# Altium schematic sheet SensorPlatformV3.SchDoc
size A4; DrawnBy: William Rigby; Engineer: William Rigby; Organization: University of Queensland; DocumentNumber: 1; Revision: C; SheetNumber: 1; SheetTotal: 1; ProjectName: Water Quality Monitor
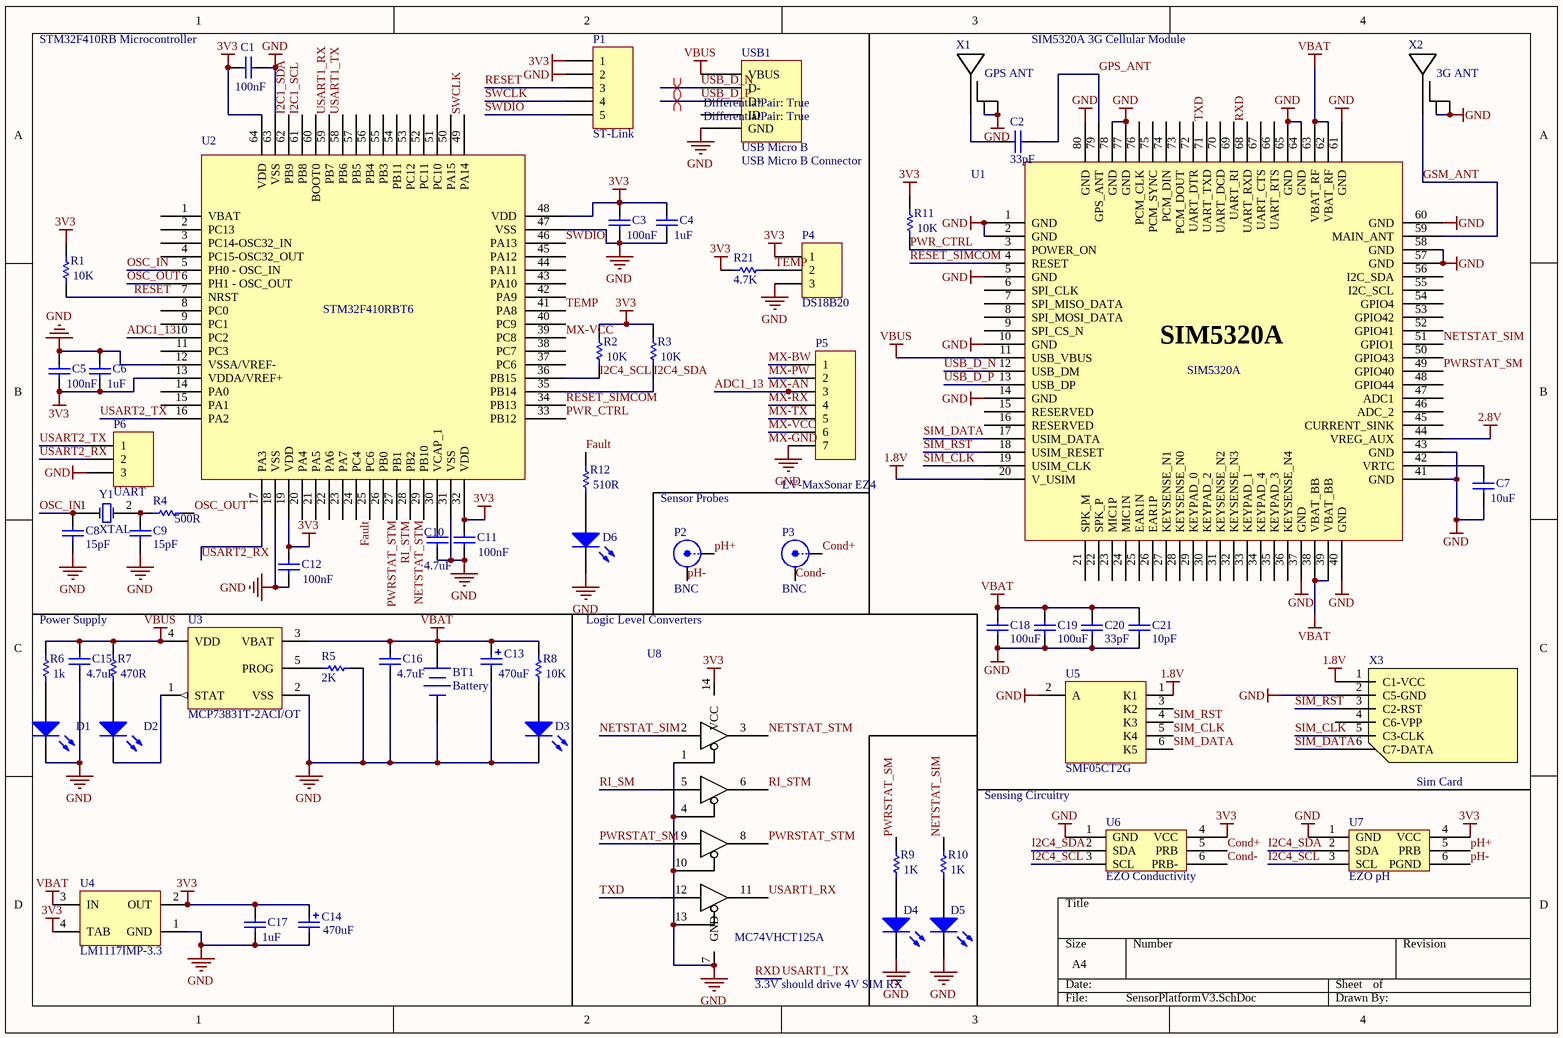
[diagram p0: SensorPlatformV3.SchDoc]

## Parts
BT1  Battery  [BAT-2]
C1  value 100nF  [1608[0603]]  (hidden comment: Cap)
C2  value 33pF  [1608[0603]]  (hidden comment: Cap)
C3  value 100nF  [1608[0603]]  (hidden comment: Cap)
C4  value 1uF  [1608[0603]]  (hidden comment: Cap)
C5  value 100nF  [1608[0603]]  (hidden comment: Cap)
C6  value 1uF  [1608[0603]]  (hidden comment: Cap)
C7  value 10uF  [1608[0603]]  (hidden comment: Cap)
C8  value 15pF  [1608[0603]]  (hidden comment: Cap)
C9  value 15pF  [1608[0603]]  (hidden comment: Cap)
C10  value 4.7uF  [1608[0603]]  (hidden comment: Cap)
C11  value 100nF  [1608[0603]]  (hidden comment: Cap)
C12  value 100nF  [1608[0603]]  (hidden comment: Cap)
C13  value 470uF  [CAPAE9983X105M]  (hidden comment: Cap Pol2)
C14  value 470uF  [CAPAE9983X105M]  (hidden comment: Cap Pol2)
C15  value 4.7uF  [1608[0603]]  (hidden comment: Cap)
C16  value 4.7uF  [1608[0603]]  (hidden comment: Cap)
C17  value 1uF  [1608[0603]]  (hidden comment: Cap)
C18  value 100uF  [1608[0603]]  (hidden comment: Cap)
C19  value 100uF  [1608[0603]]  (hidden comment: Cap)
C20  value 33pF  [1608[0603]]  (hidden comment: Cap)
C21  value 10pF  [1608[0603]]  (hidden comment: Cap)
D1  USB  [1608[0603]]  (value not drawn)
D2  Ch  [1608[0603]]  (value not drawn)
D3  Bt  [1608[0603]]  (value not drawn)
D4  PWRSTAT  [1608[0603]]  (value not drawn)
D5  NETSTAT  [1608[0603]]  (value not drawn)
D6  Fault  [1608[0603]]  (value not drawn)
P1  ST-Link  [HDR1X5]
P2  BNC  [BNC Connector]
P3  BNC  [BNC Connector]
P4  DS18B20  [HDR1X3]
P5  LV-MaxSonar EZ4  [HDR1X7]
P6  UART  [HDR1X3]
R1  value 10K  [1608[0603]]  (hidden comment: Res1)
R2  value 10K  [1608[0603]]  (hidden comment: Res1)
R3  value 10K  [1608[0603]]  (hidden comment: Res1)
R4  value 500R  [1608[0603]]  (hidden comment: Res1)
R5  value 2K  [1608[0603]]  (hidden comment: Res1)
R6  value 1k  [1608[0603]]  (hidden comment: Res1)
R7  value 470R  [1608[0603]]  (hidden comment: Res1)
R8  value 10K  [1608[0603]]  (hidden comment: Res1)
R9  value 1K  [1608[0603]]  (hidden comment: Res1)
R10  value 1K  [1608[0603]]  (hidden comment: Res1)
R11  value 10K  [1608[0603]]  (hidden comment: Res1)
R12  value 510R  [1608[0603]]  (hidden comment: Res1)
R21  value 4.7K  [1608[0603]]  (hidden comment: Res1)
U1  SIM5320A  [SIM5320A]
U2  STM32F410RBT6  [STM32F410RBT6]
U3  MCP73831T-2ACI/OT  [SOT-23-OT5_N]
U4  LM1117IMP-3.3  [MP04A_N]
U5  SMF05CT2G  [ONSC-SC70-6-419B-02_W_V]
U6  EZO Conductivity  [EZO Conductivity (No Writing)]
U7  EZO pH  [EZO pH Duplicate]
U8  MC74VHCT125A  [TSSOP-14]
USB1  USB Micro B Connector  [USB Micro B Connector]
X1  GPS ANT  [UFL Connector]
X2  3G ANT  [UFL Connector]
X3  Sim Card  [Sim Card]
Y1  XTAL  [16MHz Clock]

## Nets
1.8V: U1.20(V_USIM) U5.1(K1) X3.1(C1-VCC)
2.8V: U1.44(VREG_AUX)
3V3: C1.2 C3.2 C4.2 C5.1 C6.1 C11.2 C12.2 C14.1 C17.2 P1.1 P4.1 R1.2 R2.2 R3.2 R11.2 R21.2 U2.13(VDDA/VREF+) U2.19(VDD) U2.32(VDD) U2.48(VDD) U2.64(VDD) U4.2(OUT) U4.4(TAB) U6.4(VCC) U7.4(VCC) U8.14(VCC)
GND: BT1.2(-) C1.1 C3.1 C4.1 C5.2 C6.2 C7.1 C8.2 C9.2 C10.1 C11.1 C12.1 C13.2 C14.2 C15.1 C16.1 C17.1 C18.2 C19.2 C20.2 C21.2 D1.2(K) D3.2(K) D4.2(K) D5.2(K) D6.2(K) P1.2 P4.3 P5.7 P6.3 R5.1 U1.1(GND) U1.2(GND) U1.5(GND) U1.10(GND) U1.14(GND) U1.37(GND) U1.40(GND) U1.41(GND) U1.43(GND) U1.57(GND) U1.58(GND) U1.60(GND) U1.61(GND) U1.64(GND) U1.65(GND) U1.77(GND) U1.78(GND) U1.80(GND) U2.12(VSSA/VREF-) U2.18(VSS) U2.31(VSS) U2.47(VSS) U2.63(VSS) U3.2(VSS) U4.1(GND) U5.2(A) U6.1(GND) U7.1(GND) U8.1(OE1) U8.4(OE2) U8.7(GND) U8.10(OE3) U8.13(OE4) USB1.GND X1.2(GND) X1.3(GND) X2.2(GND) X2.3(GND) X3.2(C5-GND)
VBAT: BT1.1(+) C13.1 C16.2 C18.1 C19.1 C20.1 C21.1 R8.2 U1.38(VBAT_BB) U1.39(VBAT_BB) U1.62(VBAT_RF) U1.63(VBAT_RF) U3.3(VBAT) U4.3(IN)
VBUS: C15.2 R6.2 R7.2 U1.11(USB_VBUS) U3.4(VDD) USB1.VBUS
ADC1_13: P5.3 U2.10(PC2)  [also labelled MX-AN]
Cond+: P3.1(X) U6.5(PRB)
Cond-: P3.2(Y) U6.6(PRB-)
Fault: R12.2 U2.24(PC4)
GPS_ANT: C2.1 U1.79(GPS_ANT)
GSM_ANT: U1.59(MAIN_ANT) X2.1(SIG)
I2C1_SCL: U2.61(PB8)
I2C1_SDA: U2.62(PB9)
I2C4_SCL: R2.1 U2.36(PB15) U6.3(SCL) U7.3(SCL)
I2C4_SDA: R3.1 U2.35(PB14) U6.2(SDA) U7.2(SDA)
MX-BW: P5.1
MX-PW: P5.2
MX-RX: P5.4
MX-TX: P5.5
MX-VCC: P5.6 U2.39(PC8)
NETSTAT_SIM: R10.2 U1.51(GPIO1) U8.2(A1)
NETSTAT_STM: U2.28(PB2) U8.3(Y1)
OSC_IN: C8.1 U2.5(PH0_-_OSC_IN) Y1.1(OSC1)
OSC_OUT: R4.1 U2.6(PH1_-_OSC_OUT)
pH+: P2.1(X) U7.5(PRB)
pH-: P2.2(Y) U7.6(PGND)
PWR_CTRL: R11.1 U1.3(POWER_ON) U2.33(PB12)
PWRSTAT_SM: R9.2 U1.49(GPIO40) U8.9(A3)
PWRSTAT_STM: U2.26(PB0) U8.8(U4)
RESET: P1.3 R1.1 U2.7(NRST)
RESET_SIMCOM: U1.4(RESET) U2.34(PB13)
RI_SM: U8.5(A2)
RI_STM: U2.27(PB1) U8.6(Y2)
RXD: U1.68(UART_RXD) U2.58(PB6)  [also labelled USART1_TX]
SIM_CLK: U1.19(USIM_CLK) U5.5(K4) X3.5(C3-CLK)
SIM_DATA: U1.17(USIM_DATA) U5.6(K5) X3.6(C7-DATA)
SIM_RST: U1.18(USIM_RESET) U5.4(K3) X3.3(C2-RST)
SWCLK: P1.4 U2.49(PA14)
SWDIO: P1.5 U2.46(PA13)
TEMP: P4.2 R21.1 U2.41(PA8)
TXD: U1.71(UART_TXD) U8.12(A4)
USART1_RX: U2.59(PB7) U8.11(Y4)
USART2_RX: P6.2 U2.17(PA3)
USART2_TX: P6.1 U2.16(PA2)
USB_D_N: U1.12(USB_DM) USB1.D-
USB_D_P: U1.13(USB_DP) USB1.D+
NetC2_2: C2.2 X1.1(SIG)
NetC7_2: C7.2 U1.42(VRTC)
NetC9_1: C9.1 R4.2 Y1.2(OSC2)
NetC10_2: C10.2 U2.30(VCAP_1)
NetD1_1: D1.1(A) R6.1
NetD2_1: D2.1(A) R7.1
NetD2_2: D2.2(K) U3.1(STAT)
NetD3_1: D3.1(A) R8.1
NetD4_1: D4.1(A) R9.1
NetD5_1: D5.1(A) R10.1
NetD6_1: D6.1(A) R12.1
NetR5_2: R5.2 U3.5(PROG)

Not connected (* = marked no-connect by the designer): U1 6(SPI_CLK) 7(SPI_MISO_DATA) 8(SPI_MOSI_DATA) 9(SPI_CS_N) 15(RESERVED) 16(RESERVED) 21(SPK_M) 22(SPK_P) 23(MIC1P) 24(MIC1N) 25(EAR1N) 26(EAR1P) 27(KEYSENSE_N1) 28(KEYSENSE_N0) 29(KEYPAD_0) 30(KEYPAD_2) 31(KEYSENSE_N2) 32(KEYSENSE_N3) 33(KEYPAD_1) 34(KEYPAD_4) 35(KEYPAD_3) 36(KEYSENSE_N4) 45(CURRENT_SINK) 46(ADC_2) 47(ADC1) 48(GPIO44) 50(GPIO43) 52(GPIO41) 53(GPIO42) 54(GPIO4) 55(I2C_SCL) 56(I2C_SDA) 66(UART_RTS) 67(UART_CTS) 69(UART_RI) 70(UART_DCD) 72(UART_DTR) 73(PCM_DOUT) 74(PCM_DIN) 75(PCM_SYNC) 76(PCM_CLK); U2 1(VBAT) 2(PC13) 3(PC14-OSC32_IN) 4(PC15-OSC32_OUT) 8(PC0) 9(PC1) 11(PC3) 14(PA0) 15(PA1) 20(PA4) 21(PA5) 22(PA6) 23(PA7) 25(PC6) 29(PB10) 37(PC6) 38(PC7) 40(PC9) 42(PA9) 43(PA10) 44(PA11) 45(PA12) 50(PA15) 51(PC10) 52(PC11) 53(PC12) 54(PB11) 55(PB3) 56(PB4) 57(PB5) 60(BOOT0); U5 3(K2); USB1 ID; X3 4(C6-VPP)

## Layout directives
differential pair: USB_D_N, USB_D_P

## Notes on the sheet
- (near C1) STM32F410RB Microcontroller
- SIM5320A 3G Cellular Module
- Sensor Probes
- Power Supply
- Logic Level Converters
- Sensing Circuitry
- 3.3V should drive 4V SIM RX
- Labels drawn without touching a wire or pin: MX-GND
- (in symbol USB Micro B Connector) USB Micro B

## Library data of the parts
BT1 = Battery: Multicell Battery; Published: 24-Mar-1999; LatestRevisionDate: 17-Jul-2002; LatestRevisionNote: Re-released for DXP Platform.; PackageReference: BAT-2; Publisher: Altium Limited; PackageDescription: Battery; 2 Leads
C1-C12 C15-C21 = Cap: Capacitor; Published: 8-Jun-2000; LatestRevisionDate: 17-Jul-2002; LatestRevisionNote: Re-released for DXP Platform.; PackageReference: RAD-0.3; Publisher: Altium Limited; PackageDescription: Radial Cap, Thru-Hole; 2 Leads; 0.3 in Pin Spacing
C13 C14 = Cap Pol2: Polarized Capacitor (Axial); Published: 8-Jun-2000; LatestRevisionDate: 17-Jul-2002; LatestRevisionNote: Re-released for DXP Platform.; PackageReference: POLAR0.8; Publisher: Altium Limited; PackageDescription: Polarized Capacitor; 2 Leads
D1-D6 = LED0: Typical INFRARED GaAs LED; Published: 8-Jun-2000; LatestRevisionDate: 08-Jul-2005; LatestRevisionNote: Mech Layer 1 removed.; PackageReference: LED-0; Publisher: Altium Limited; PackageDescription: LED; 2 Leads
P1 = Header 5: Header, 5-Pin; LatestRevisionDate: 17-Jul-2002; LatestRevisionNote: Re-released for DXP Platform.; Publisher: Altium Limited
P2 P3 = BNC: BNC Elbow Connector; LatestRevisionDate: 17-Jul-2002; LatestRevisionNote: Re-released for DXP Platform.; Publisher: Altium Limited
P4 P6 = Header 3: Header, 3-Pin; LatestRevisionDate: 17-Jul-2002; LatestRevisionNote: Re-released for DXP Platform.; Publisher: Altium Limited
P5 = Header 7: Header, 7-Pin; LatestRevisionDate: 17-Jul-2002; LatestRevisionNote: Re-released for DXP Platform.; Publisher: Altium Limited
R1-R12 R21 = Res1: Resistor; Published: 8-Jun-2000; LatestRevisionDate: 17-Jul-2002; LatestRevisionNote: Re-released for DXP Platform.; PackageReference: AXIAL-0.3; Publisher: Altium Limited; PackageDescription: Axial Device, Thru-Hole; 2 Leads; 0.3 in Pin Spacing
U3 = MCP73831T-2ACI/OT: Miniature Single-Cell, Fully Integrated Li-Ion, Li-Polymer Charge Management Controller, 4.2V, 5-Pin SOT-23, Industrial Temperature, Tape and Reel; Manufacturer: Microchip; DatasheetVersion: revE, Sep-2008; PackageVersion: revBB, Aug-2009; PackageReference: SOT-23-OT5; PackageDescription: 5-Lead Plastic Small Outline Transistor (OT) [SOT-23]; Supplier 1: Digi-Key; Supplier Part Number 1: MCP73831T-2ACI/OTTR-ND; Supplier 2: Digi-Key; Supplier Part Number 2: MCP73831T-2ACI/OTCT-ND; Supplier 3: Digi-Key; Supplier Part Number 3: MCP73831T-2ACI/OTDKR-ND; Supplier 4: Farnell; Supplier Part Number 4: 1332158; Supplier 5: Farnell; Supplier Part Number 5: 1332158RL; Supplier 6: Newark; Supplier Part Number 6: 56K7045; Supplier 7: Mouser; Supplier Part Number 7: 579-MCP73831T-2ACIOT; Mounting Technology: Surface Mount; Code_IPC: SOT23-5; PartNumber: MCP73831T-2ACI/OT; ComponentLink1Description: Manufacturer URL; ComponentLink1URL: http://www.microchip.com/; ComponentLink2Description: Datasheet; ComponentLink2URL: http://ww1.microchip.com/downloads/en/DeviceDoc/21984e.pdf; ComponentLink3Description: Package Specification; ComponentLink3URL: http://www.microchip.com/stellent/groups/techpub_sg/documents/packagingspec/en012702.pdf
U4 = LM1117IMP-3.3: 800mA Low-Dropout Linear Regulator, 4-pin SOT-223; Manufacturer: National Semiconductor; PackageTopMarking: XYTT*N05B; PowerWise: N; CompType: LDO IC; High-Reliability: Y; DatasheetVersion: Apr-2006; PackageVersion: revB, Apr-2003; PackageReference: MP04A; PackageDescription: Molded SOT-223, 6.50 x 3.56 x 1.6mm Body, 4 Lead, 2.3mm Pitch; PartNumber: LM1117IMP-3.3; RoHS: N; PinCount: 4; Code_JEDEC: TO-261-AA; Code_IPC: SOT223-4; ComponentLink1Description: Manufacturer URL; ComponentLink1URL: http://www.national.com/; ComponentLink2Description: LM1117 Datasheet; ComponentLink2URL: http://www.national.com/ds/LM/LM1117.pdf; ComponentLink3Description: LM1117 Web Page; ComponentLink3URL: http://www.national.com/pf/LM/LM1117.html; ComponentLink4Description: MP04A Package Page; ComponentLink4URL: http://www.national.com/packaging/folders/mp04a.html
U5 = SMF05CT2G: 5-Line Transient Voltage Suppressor Array, 6-Pin SC70, Pb-Free, Tape and Reel; Manufacturer: On Semiconductor; Direction: Unidirectional; IR Max (uA): 5; PPK Max (W): 100; DatasheetVersion: Rev. 4; PackageVersion: Rev. W; PackageReference: SC70-6-419B-02_W; PackageDescription: 6-Pin Small Outline Transistor, Body 2 x 1.25 mm, Pitch 0.65 mm; Supplier 1: Digi-Key; Supplier Part Number 1: SMF05CT2GOSTR-ND; Supplier 2: Digi-Key; Supplier Part Number 2: SMF05CT2GOSCT-ND; Supplier 3: Digi-Key; Supplier Part Number 3: SMF05CT2GOSDKR-ND; Supplier 4: Farnell; Supplier Part Number 4: 2317486; Supplier 5: Newark; Supplier Part Number 5: 09R9713; Supplier 6: Newark; Supplier Part Number 6: 45J2265; Supplier 7: Mouser; Supplier Part Number 7: 863-SMF05CT2G; Packing: Tape and Reel; RoHS: Pb-Free; Mounting Technology: Surface Mount; PartNumber: SMF05CT2G; ComponentLink1Description: Manufacturer URL; ComponentLink1URL: http://www.onsemi.com/; ComponentLink2Description: Datasheet; ComponentLink2URL: http://www.onsemi.com/pub_link/Collateral/SMF05C-D.PDF; ComponentLink3Description: Package Specification; ComponentLink3URL: http://www.onsemi.com/pub_link/Collateral/SMF05C-D.PDF
X1 X2 = UFL Antenna
X3 = SIMCARD
Y1 = XTAL: Crystal Oscillator; Published: 8-Jun-2000; LatestRevisionDate: 17-Jul-2002; LatestRevisionNote: Re-released for DXP Platform.; PackageReference: R38; Publisher: Altium Limited; PackageDescription: Crystal, Thru-Hole; 2 Leads; Body 3.1 x 8.2 mm (Dia.xH)